# EAGLE design mojo_shield (EAGLE 8.7.1)
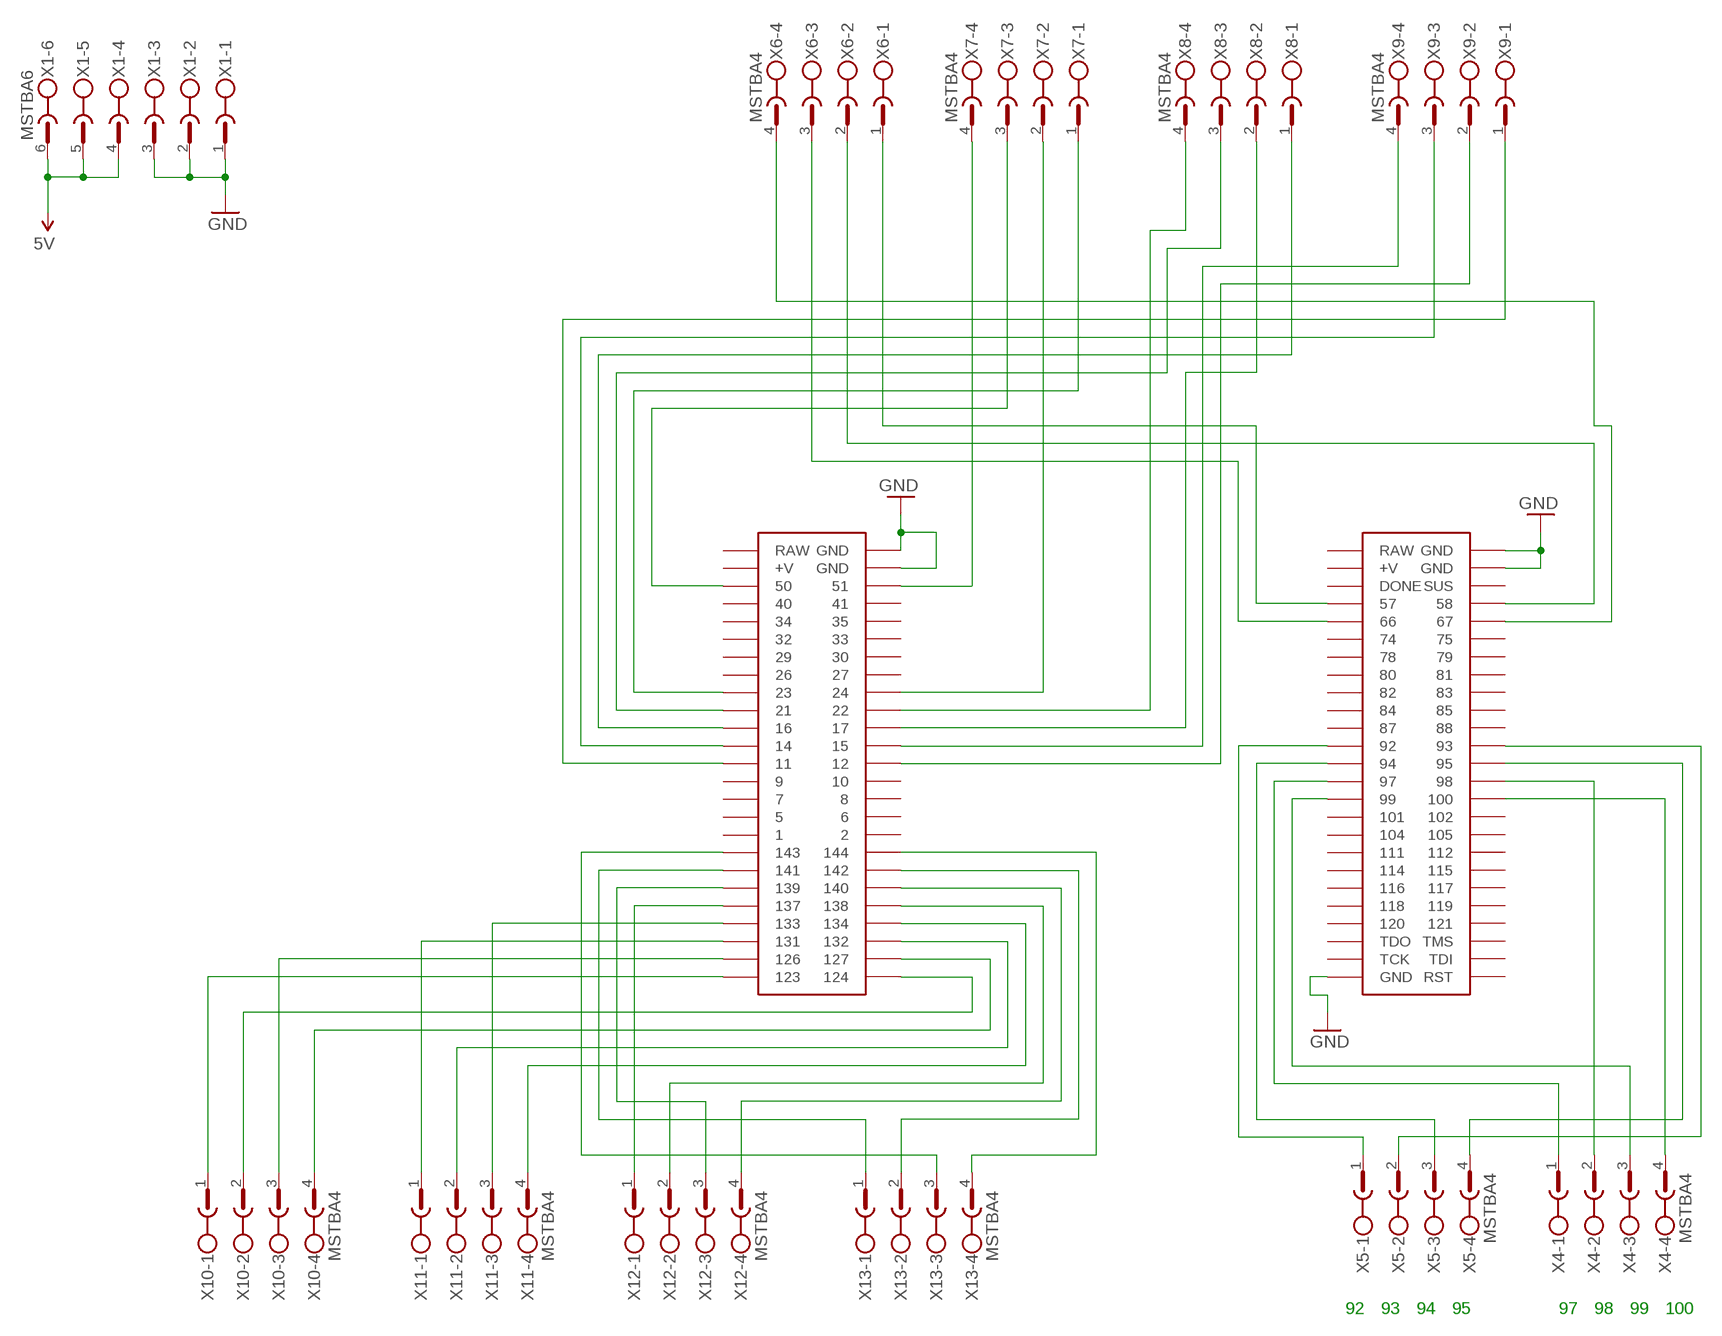
[diagram p0: schematic, sheet 1]

## Parts
U$1  MOJO_V2V3_NO_LABEL  [MOJO_V3_NO_LABEL]
X1  MSTBA6  [MSTBA6]
X4  MSTBA4  [MSTBA4]
X5  MSTBA4  [MSTBA4]
X6  MSTBA4  [MSTBA4]
X7  MSTBA4  [MSTBA4]
X8  MSTBA4  [MSTBA4]
X9  MSTBA4  [MSTBA4]
X10  MSTBA4  [MSTBA4]
X11  MSTBA4  [MSTBA4]
X12  MSTBA4  [MSTBA4]
X13  MSTBA4  [MSTBA4]

## Nets
5V: X1.4 X1.5 X1.6
GND: U$1.GND@1(GND) U$1.GND@2(GND) U$1.GND@3(GND) U$1.GND@4(GND) U$1.GND@6(GND) X1.1 X1.2 X1.3
N$1: U$1.50 X7.3
N$2: U$1.51 X7.4
N$3: U$1.23 X7.1
N$4: U$1.24 X7.2
N$5: U$1.11 X9.1
N$6: U$1.12 X9.2
N$7: U$1.15 X9.4
N$8: U$1.17 X8.2
N$9: U$1.22 X8.4
N$10: U$1.21 X8.3
N$11: U$1.16 X8.1
N$12: U$1.14 X9.3
N$13: U$1.133 X11.3
N$14: U$1.134 X11.4
N$15: U$1.123 X10.1
N$16: U$1.124 X10.2
N$17: U$1.99 X4.3
N$18: U$1.100 X4.4
N$19: U$1.92 X5.1
N$20: U$1.93 X5.2
N$21: U$1.66 X6.3
N$22: U$1.57 X6.1
N$23: U$1.58 X6.2
N$24: U$1.67 X6.4
N$25: U$1.94 X5.3
N$26: U$1.97 X4.1
N$27: U$1.95 X5.4
N$28: U$1.98 X4.2
N$29: U$1.132 X11.2
N$30: U$1.127 X10.4
N$31: U$1.131 X11.1
N$32: U$1.126 X10.3
N$33: U$1.137 X12.1
N$34: U$1.138 X12.2
N$35: U$1.144 X13.4
N$36: U$1.142 X13.2
N$37: U$1.140 X12.4
N$38: U$1.143 X13.3
N$39: U$1.141 X13.1
N$40: U$1.139 X12.3
Unconnected: U$1.1 U$1.2 U$1.5 U$1.6 U$1.7 U$1.8 U$1.9 U$1.10 U$1.26 U$1.27 U$1.29 U$1.30 U$1.32 U$1.33 U$1.34 U$1.35 U$1.40 U$1.41 U$1.74 U$1.75 U$1.78 U$1.79 U$1.80 U$1.81 U$1.82 U$1.83 U$1.84 U$1.85 U$1.87 U$1.88 U$1.101 U$1.102 U$1.104 U$1.105 U$1.111 U$1.112 U$1.114 U$1.115 U$1.116 U$1.117 U$1.118 U$1.119 U$1.120 U$1.121 U$1.A0 U$1.A1 U$1.A4 U$1.A5 U$1.A6 U$1.A7 U$1.A8 U$1.A9 U$1.DONE U$1.RST U$1.SUS U$1.TCK U$1.TDI U$1.TDO U$1.TMS

## Notes on the sheet
- 92 | 93 | 94 | 95 | 97 | 98 | 99 | 100

## Power pins joined to a net without a drawn wire
+V: U$1.V@1(+V) U$1.V@2(+V)
AREF: U$1.AREF
GND: U$1.GND@5(GND)
RAW: U$1.RAW@1(RAW) U$1.RAW@2(RAW)

## Library data of the parts
U$1 = embeddedmicro:MOJO_V2
X1 = con-phoenix-508:MSTBA6: PHOENIX; MF: FARNELL; MPN: 1757284; OC_FARNELL: 3705213; OC_NEWARK: 71C4165
X4-X13 = con-phoenix-508:MSTBA4: PHOENIX; MF: FARNELL; MPN: 1757268; OC_FARNELL: 3705195; OC_NEWARK: 71C4163

## Board
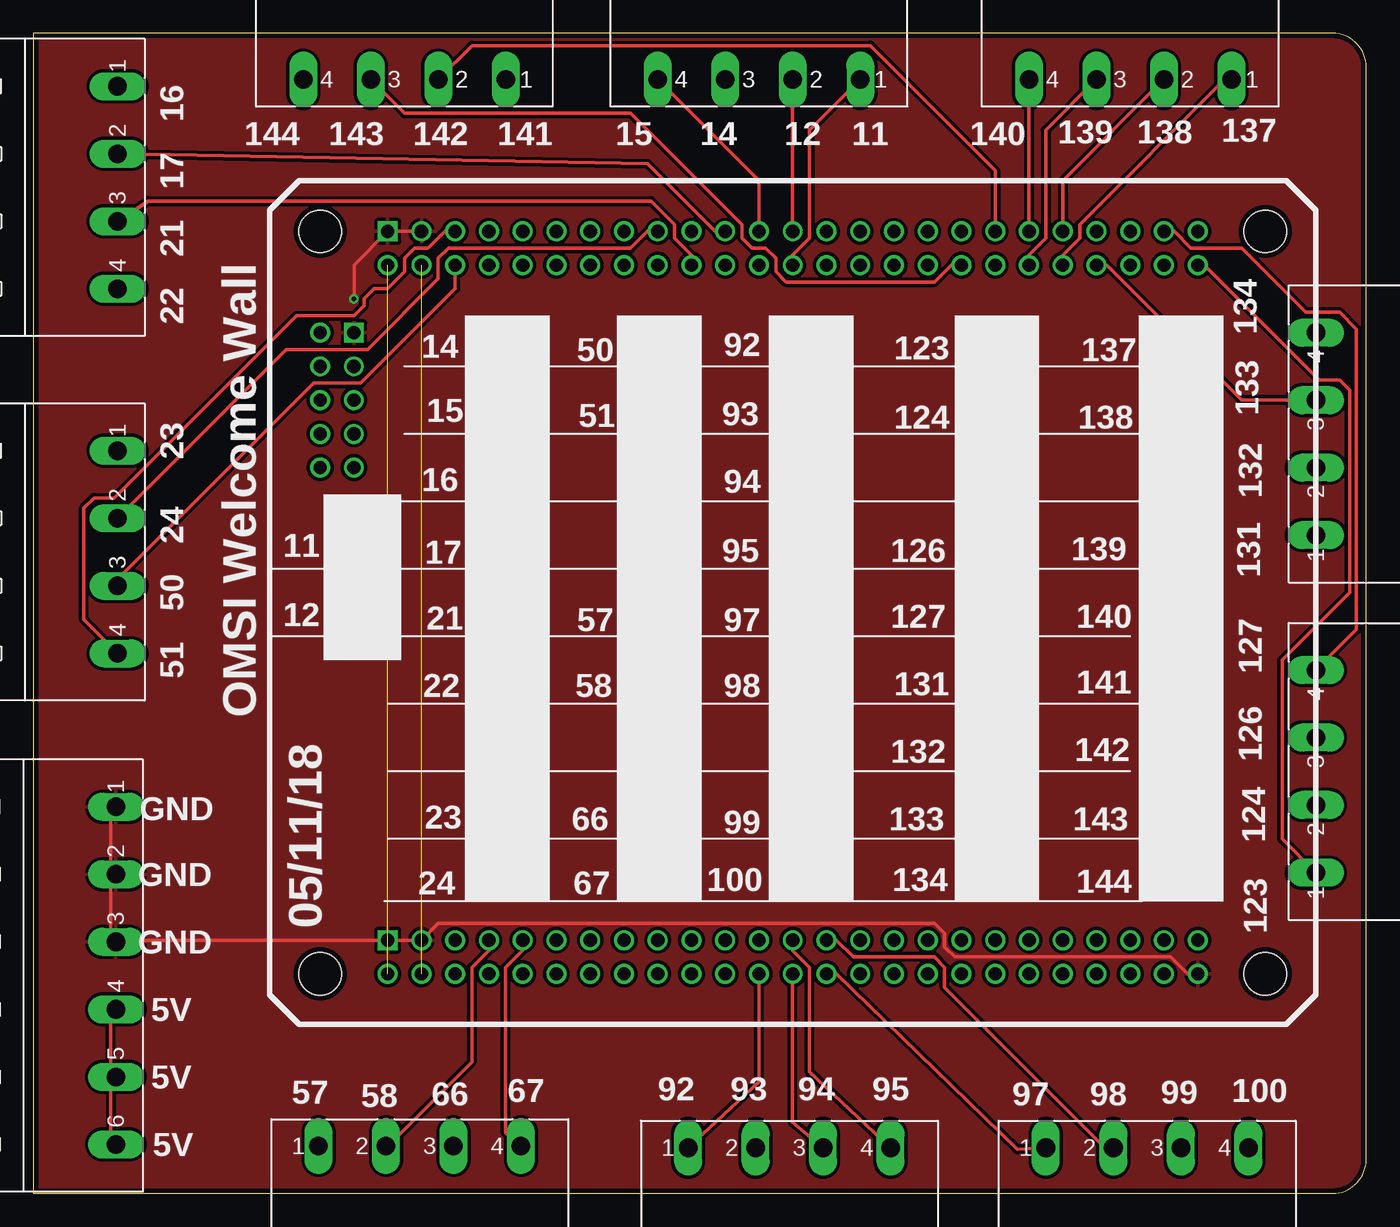
[diagram p1: board, top side]
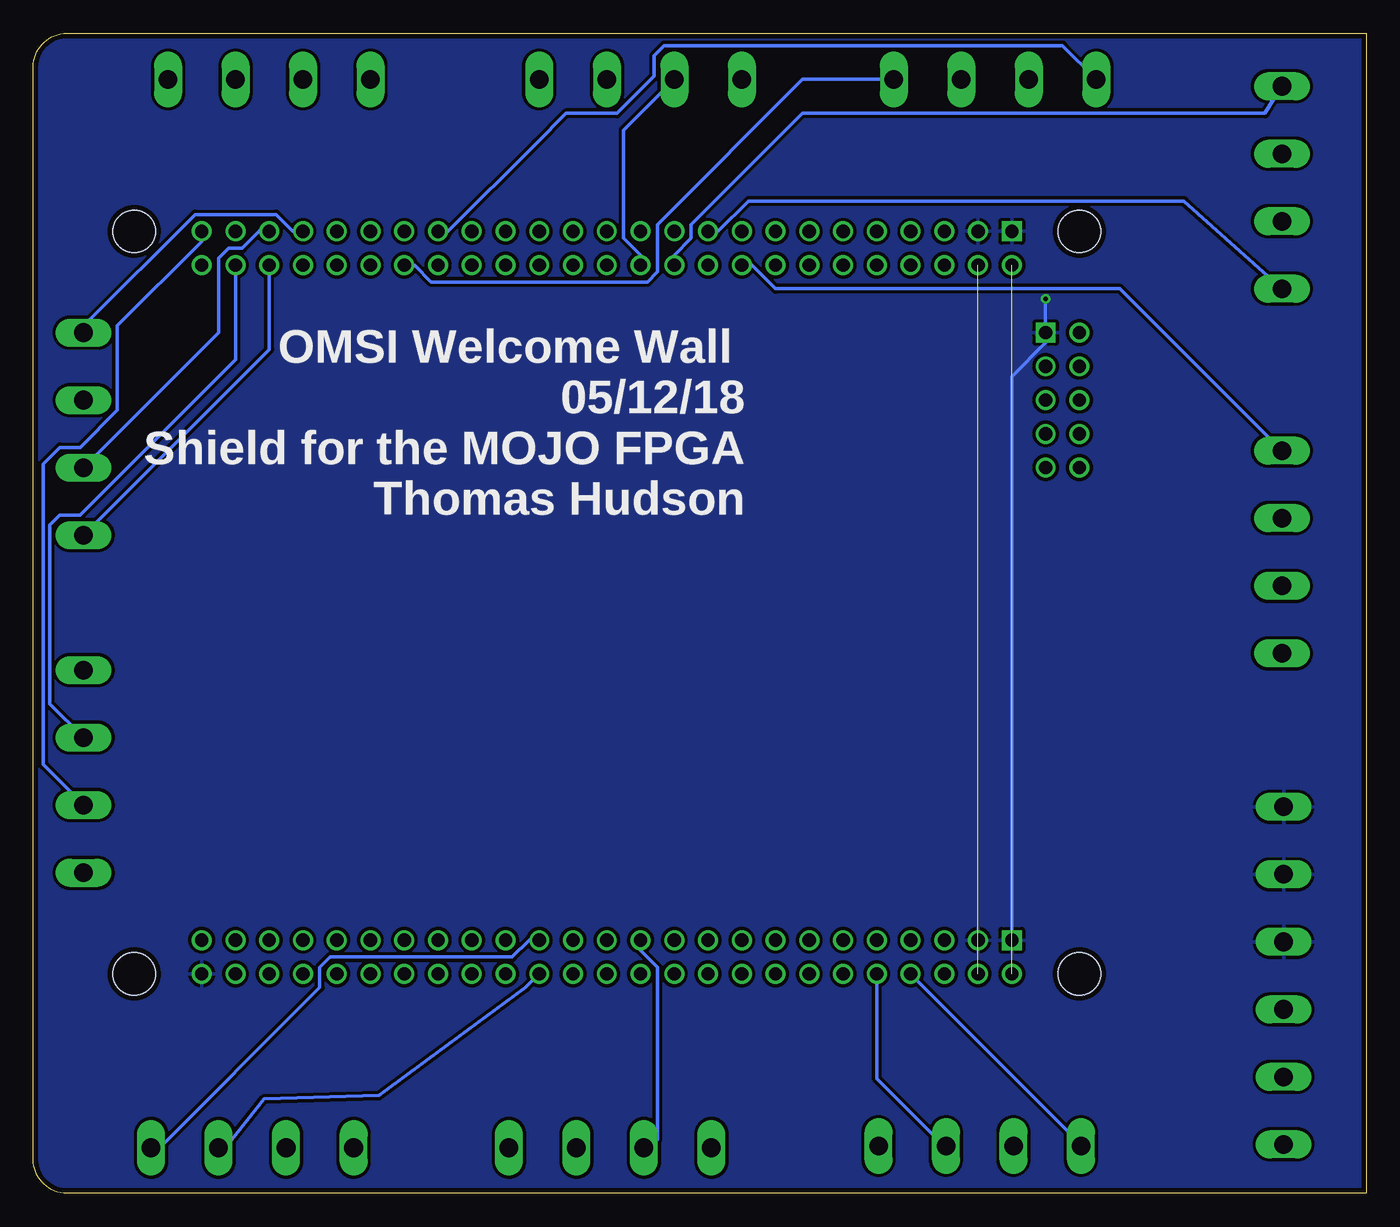
[diagram p2: board, bottom side, seen from below]

Size 100.31 x 87.3 mm. Coordinates in mm from the lower left corner, seen from the top.
Outline: 0,0 97.77,0 arc90 100.31,2.54 100.31,84.76 arc90 97.77,87.3 0,87.3 0,0
Copper layers (1*16): Top 0.0356mm / dielectric 1.5011mm / Bottom 0.0356mm
Design rules "LaenPCBOrder *": minimum track width 10mil, minimum drill 13mil, track to track 10mil, track to pad 10mil, pad to pad 10mil, via to via 10mil, smd to smd 10mil, copper to edge 15mil, drill to drill 6mil, minimum pad ring 7mil, minimum via ring 7mil, stop-mask expansion 3mil, vias tented up to drill 30mil, thermal gap 10mil

### Footprints (pad centres in the part's own frame; a part is rotated, then mirrored left to right if it is on the bottom)
MOJO_V3_NO_LABEL = drill 1: 1 49.53,57.15; 2 49.53,59.69; 5 46.99,57.15; 6 46.99,59.69; 7 44.45,57.15; 8 44.45,59.69; 9 41.91,57.15; 10 41.91,59.69; 11 39.37,57.15; 12 39.37,59.69; 14 36.83,57.15; 15 36.83,59.69; 16 34.29,57.15; 17 34.29,59.69; 21 31.75,57.15; 22 31.75,59.69; 23 29.21,57.15; 24 29.21,59.69; 26 26.67,57.15; 27 26.67,59.69; 29 24.13,57.15; 30 24.13,59.69; 32 21.59,57.15; 33 21.59,59.69; 34 19.05,57.15; 35 19.05,59.69; 40 16.51,57.15; 41 16.51,59.69; 50 13.97,57.15; 51 13.97,59.69; 57 16.51,3.81; 58 16.51,6.35; 66 19.05,3.81; 67 19.05,6.35; 74 21.59,3.81; 75 21.59,6.35; 78 24.13,3.81; 79 24.13,6.35; 80 26.67,3.81; 81 26.67,6.35; 82 29.21,3.81; 83 29.21,6.35; 84 31.75,3.81; 85 31.75,6.35; 87 34.29,3.81; 88 34.29,6.35; 92 36.83,3.81; 93 36.83,6.35; 94 39.37,3.81; 95 39.37,6.35; 97 41.91,3.81; 98 41.91,6.35; 99 44.45,3.81; 100 44.45,6.35; 101 46.99,3.81; 102 46.99,6.35; 104 49.53,3.81; 105 49.53,6.35; 111 52.07,3.81; 112 52.07,6.35; 114 54.61,3.81; 115 54.61,6.35; 116 57.15,3.81; 117 57.15,6.35; 118 59.69,3.81; 119 59.69,6.35; 120 62.23,3.81; 121 62.23,6.35; 123 69.85,57.15; 124 69.85,59.69; 126 67.31,57.15; 127 67.31,59.69; 131 64.77,57.15; 132 64.77,59.69; 133 62.23,57.15; 134 62.23,59.69; 137 59.69,57.15; 138 59.69,59.69; 139 57.15,57.15; 140 57.15,59.69; 141 54.61,57.15; 142 54.61,59.69; 143 52.07,57.15; 144 52.07,59.69; A0 6.35,41.91; A1 3.81,41.91; A4 6.35,44.45; A5 3.81,44.45; A6 6.35,46.99; A7 3.81,46.99; A8 6.35,49.53; A9 3.81,49.53; AREF 3.81,52.07; DONE 13.97,3.81; GND@2 11.43,59.69; GND@4 11.43,6.35; GND@6 69.85,3.81; RAW@1 8.89,57.15; RAW@2 8.89,3.81; RST 69.85,6.35; SUS 13.97,6.35; TCK 67.31,3.81; TDI 67.31,6.35; TDO 64.77,3.81; TMS 64.77,6.35; V@1 11.43,57.15; V@2 11.43,3.81 | drill 1 square: GND@1 8.89,59.69; GND@3 8.89,6.35; GND@5 6.35,52.07 | hole 3.2: 3.81,3.81; 3.81,59.69; 74.93,59.69; 74.93,3.81
MSTBA6 = drill 1.397 long: 1 -12.7,5.08; 2 -7.62,5.08; 3 -2.54,5.08; 4 2.54,5.08; 5 7.62,5.08; 6 12.7,5.08
MSTBA4 = drill 1.397 long: 1 -7.62,5.08; 2 -2.54,5.08; 3 2.54,5.08; 4 7.62,5.08

### Placement (x,y rotation side)
U$1  17.78,12.7 0 top
X1  1.14,16.38 270 top
X4  83.82,-1.65 0 top
X5  56.9,-1.65 0 top
X6  29.08,-1.52 0 top
X7  1.27,48.26 270 top
X8  1.27,75.69 270 top
X9  54.61,88.9 180 top
X10  101.6,31.75 90 top
X11  101.6,57.15 90 top
X12  82.55,88.9 180 top
X13  27.94,88.9 180 top

### Tracks (layer width: path | path; a pad name or v marks a point on that pad's centre or on a via)
5V
  Top 0.254: 5.84,8.89 5.84,3.81 X1.6 | 5.84,8.89 5.84,13.97 X1.4 | 5.84,8.89 X1.5
+V  (1 unrouted)
GND  (via drill 0.33)
  Top 0.254: 5.84,24.13 5.84,19.05 | 5.84,24.13 5.84,29.21 X1.1 | 5.84,24.13 X1.2 | v24.13,67.31 24.13,69.85 U$1.GND@1 U$1.GND@2 | U$1.GND@6 86.87,16.51 85.6,17.78 69.34,17.78 68.58,18.54 68.58,19.56 67.82,20.32 30.48,20.32 U$1.GND@4 U$1.GND@3 5.84,19.05 | 5.84,19.05 X1.3
  Bottom 0.254: v24.13,67.31 U$1.GND@5 24.13,64.01 26.67,61.47 U$1.GND@3
  pour Bottom (isolate 0): 101.6,87.63 101.6,0 -2.54,-1.27 -2.03,88.14
  pour Top (isolate 0): -1.27,-2.16 102.74,-0.63 100.84,87.5 0,88.9
N$1
  Top 0.254: U$1.50 31.75,68.07 24.64,60.96 21.08,60.96 6.35,46.23 X7.3
N$2
  Top 0.254: U$1.51 30.99,72.39 29.72,71.12 28.7,71.12 27.94,70.36 27.94,69.34 26.67,68.07 25.65,68.07 24.89,67.31 24.89,66.8 24.13,66.04 19.81,66.04 6.1,52.32 4.57,52.32 3.81,51.56 3.81,43.18 X7.4
N$3
  Bottom 0.254: U$1.23 46.23,69.85 44.45,68.07 18.54,68.07 X7.1
N$4
  Top 0.254: U$1.24 46.23,72.39 44.96,71.12 31.24,71.12 30.48,70.36 30.48,68.83 25.15,63.5 19.05,63.5 X7.2
N$5
  Top 0.254: U$1.11 57.15,70.61 58.42,71.88 58.42,80.01 X9.1
N$6
  Top 0.254: X9.2 U$1.12
N$7
  Top 0.254: U$1.15 54.61,76.2 X9.4
N$8
  Top 0.254: U$1.17 51.31,72.39 46.23,77.47 X8.2
N$9
  Bottom 0.254: U$1.22 48.77,72.39 46.48,74.68 13.72,74.68 X8.4
N$10
  Top 0.254: U$1.21 49.53,70.61 48.26,71.88 48.26,72.9 46.48,74.68 8.64,74.68 X8.3
N$11
  Bottom 0.254: U$1.16 52.07,70.61 50.8,71.88 50.8,72.9 42.42,81.28 7.62,81.28 X8.1
N$12
  Bottom 0.254: U$1.14 54.61,70.61 55.88,71.88 55.88,80.01 X9.3
N$13
  Top 0.254: U$1.133 80.77,69.85 90.93,59.69 X11.3
N$14
  Bottom 0.254: U$1.134 80.77,72.39 82.04,73.66 88.14,73.66 96.52,65.28 X11.4
N$15
  Top 0.254: U$1.123 88.14,69.85 96.77,61.21 98.3,61.21 99.06,60.45 99.06,45.21 93.98,40.13 93.98,26.67 X10.1
N$16
  Bottom 0.254: U$1.124 87.63,71.63 93.98,65.28 93.98,58.93 96.77,56.13 98.3,56.13 99.57,54.86 99.57,32.26 X10.2
N$17
  Bottom 0.254: U$1.99 63.25,15.49 74.3,7.37 82.93,7.11 86.36,2.79 X4.3
N$18
  Bottom 0.254: U$1.100 62.99,19.05 64.26,17.78 77.98,17.78 78.74,17.02 78.74,15.49 91.44,2.79 X4.4
N$19
  Top 0.254: U$1.92 54.61,8.38 X5.1
N$20
  Bottom 0.254: U$1.93 54.61,18.29 53.34,17.02 53.34,4.06 X5.2
N$21
  Bottom 0.254: U$1.66 36.83,8.64 31.75,3.56 X6.3
N$22
  Bottom 0.254: U$1.57 21.34,3.56 X6.1
N$23
  Top 0.254: U$1.58 34.29,18.29 33.02,17.02 33.02,9.91 26.67,3.56 X6.2
N$24
  Top 0.254: U$1.67 36.83,18.29 35.56,17.02 35.56,4.57 36.58,3.56 X6.4
N$25
  Top 0.254: U$1.94 57.15,5.33 X5.3
N$26
  Top 0.254: U$1.97 60.45,16.51 74.04,3.3 X4.1
N$27
  Top 0.254: U$1.95 57.15,18.29 58.42,17.02 58.42,9.14 X5.4
N$28
  Top 0.254: U$1.98 60.45,19.05 61.72,17.78 67.82,17.78 68.58,17.02 68.58,15.49 81.28,2.79 X4.2
N$29
  Bottom 0.254: U$1.132 83.31,72.39 84.58,71.12 85.6,71.12 86.36,70.36 86.36,64.77 X11.2
N$30
  Top 0.254: U$1.127 85.85,72.39 87.12,71.12 90.93,71.12 95.76,66.29 98.3,66.29 99.57,65.02 99.57,42.42 X10.4
N$31
  Bottom 0.254: U$1.131 82.55,63.5 X11.1
N$32
  Bottom 0.254: U$1.126 85.09,62.74 96.77,51.05 98.3,51.05 99.06,50.29 99.06,36.83 X10.3
N$33
  Top 0.254: U$1.137 77.47,70.61 78.74,71.88 78.74,72.9 89.66,83.82 X12.1
N$34
  Top 0.254: U$1.138 77.47,76.2 X12.2
N$35
  Bottom 0.254: U$1.144 69.09,72.39 62.48,78.99 60.2,81.28 56.39,81.28 53.59,84.07 53.59,85.6 52.83,86.36 22.86,86.36 X13.4
N$36
  Top 0.254: U$1.142 72.39,76.96 62.99,86.36 33.02,86.36 X13.2
N$37
  Top 0.254: X12.4 U$1.140
N$38
  Top 0.254: U$1.143 69.09,69.85 67.82,68.58 56.64,68.58 55.88,69.34 55.88,70.36 55.12,71.12 54.1,71.12 53.34,71.88 53.34,72.9 44.96,81.28 27.94,81.28 X13.3
N$39
  Bottom 0.254: U$1.141 71.63,69.85 70.36,68.58 54.1,68.58 53.34,69.34 53.34,72.9 42.42,83.82 X13.1
N$40
  Top 0.254: U$1.139 74.93,70.61 76.2,71.88 76.2,80.01 X12.3
RAW  (1 unrouted)

### Text on the board
tPlace: 16 | 137 | 144 | 143 | 142 | 141 | 15 | 14 | 12 | 11 | 140 | 139 | 138 | 17 | 21 | 22 | 92 | 134 | 14 | 50 | 123 | 137 | 93 | 133 | 15 | 51 | 124 | 138 | 23 | 16 | 94 | 132 | 95 | 24 | 11 | 17 | 126 | 139 | 131 | 57 | 97 | 50 | 12 | 21 | 127 | 140 | 58 | 98 | 127 | 51 | 22 | 131 | 141 | OMSI Welcome Wall | 132 | 142 | 126 | GND | 66 | 99 | 23 | 133 | 143 | 124 | GND | 24 | 67 | 100 | 134 | 144 | GND | 05/11/18 | 123 | 5V | 5V | 57 | 58 | 66 | 67 | 92 | 93 | 94 | 95 | 97 | 98 | 99 | 100 | 5V
bPlace: OMSI Welcome Wall / 05/12/18 / Shield for the MOJO FPGA / Thomas Hudson